# Altium schematic sheet 02_CtrlExp_Link.SchDoc: -
size A4; Date: -; ApprovedBy: -; CheckedBy: -; Author: -; CompanyName: -; DrawnBy: -; Engineer: -; Organization: Komax AG; Address1: -; Address2: -; Address3: -; Address4: -; DocumentNumber: -; Revision: -; SheetNumber: 2; SheetTotal: 8; KSDP_ObjectName: CtrlExp Link; KSDP_CreatedBy: Patrick Rossacher; KSDP_CreationDate: 20.12.2017; KSDP_ModificationDate: -; KSDP_ModifiedBy: -; CurrentTime: -; CurrentDate: -; Time: -; DocumentFullPathAndName: -; DocumentName: -; ModifiedDate: -; ImagePath: -
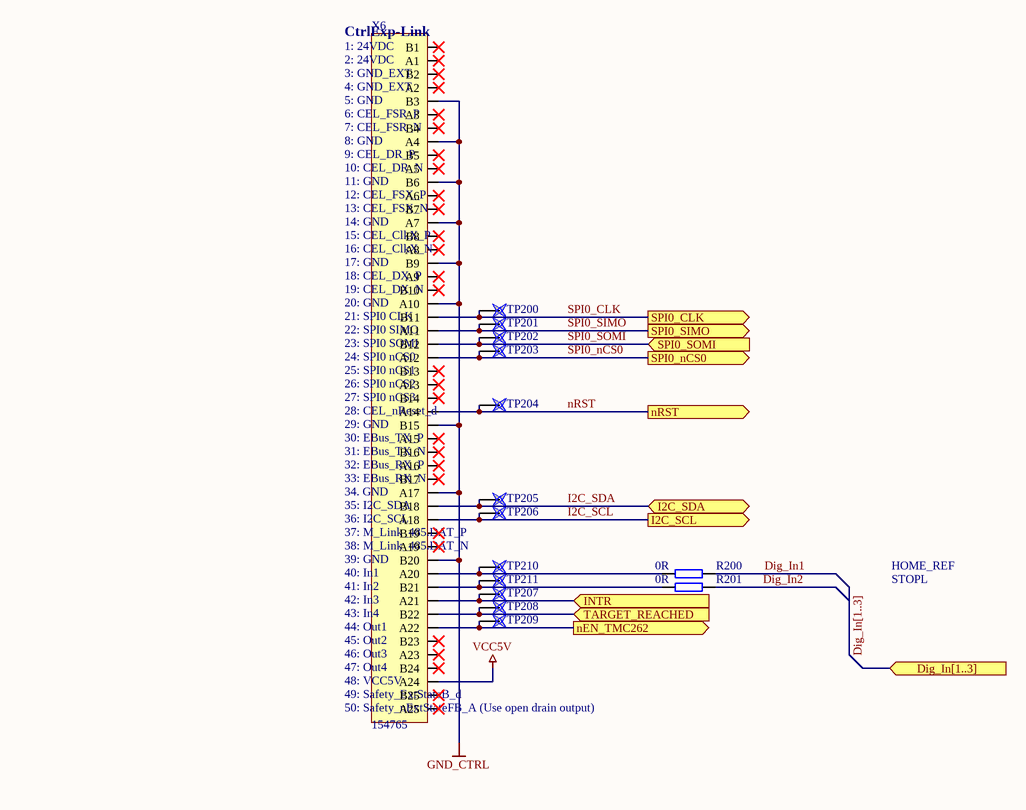
[diagram p0: 02_CtrlExp_Link.SchDoc]

## Parts
R200  0R  [0402_R]
R201  0R  [0402_R]
TP200  Testpoint  [TP1.5MM]  (value not drawn)  (no BOM)
TP201  Testpoint  [TP1.5MM]  (value not drawn)  (no BOM)
TP202  Testpoint  [TP1.5MM]  (value not drawn)  (no BOM)
TP203  Testpoint  [TP1.5MM]  (value not drawn)  (no BOM)
TP204  Testpoint  [TP1.5MM]  (value not drawn)  (no BOM)
TP205  Testpoint  [TP1.5MM]  (value not drawn)  (no BOM)
TP206  Testpoint  [TP1.5MM]  (value not drawn)  (no BOM)
TP207  Testpoint  [TP1.5MM]  (value not drawn)  (no BOM)
TP208  Testpoint  [TP1.5MM]  (value not drawn)  (no BOM)
TP209  Testpoint  [TP1.5MM]  (value not drawn)  (no BOM)
TP210  Testpoint  [TP1.5MM]  (value not drawn)  (no BOM)
TP211  Testpoint  [TP1.5MM]  (value not drawn)  (no BOM)
X6  154765  [CON_SMD_50P_ERNI_154765]

## Ports
Dig_In[1..3] (in), I2C_SCL (out), I2C_SDA (bidir), INTR (in), nEN_TMC262 (out), nRST (out), SPI0_CLK (out), SPI0_nCS0 (out), SPI0_SIMO (out), SPI0_SOMI (in), TARGET_REACHED (in)

## Nets
GND_CTRL: X6.A4 X6.A7 X6.A10 X6.A17 X6.B3 X6.B6 X6.B9 X6.B15 X6.B20
VCC5V: X6.A24
Dig_In1: R200.2
Dig_In2: R201.2
I2C_SCL: TP206.1 X6.A18 ; port I2C_SCL
I2C_SDA: TP205.1 X6.B18 ; port I2C_SDA
INTR: TP207.1 X6.A21 ; port INTR
nEN_TMC262: TP209.1 X6.A22 ; port nEN_TMC262
nRST: TP204.1 X6.A14 ; port nRST
SPI0_CLK: TP200.1 X6.B11 ; port SPI0_CLK
SPI0_nCS0: TP203.1 X6.A12 ; port SPI0_nCS0
SPI0_SIMO: TP201.1 X6.A11 ; port SPI0_SIMO
SPI0_SOMI: TP202.1 X6.B12 ; port SPI0_SOMI
TARGET_REACHED: TP208.1 X6.B22 ; port TARGET_REACHED
NetR200_1: R200.1 TP210.1 X6.A20
NetR201_1: R201.1 TP211.1 X6.B21

Not connected (* = marked no-connect by the designer): X6 A1* A2* A3* A5* A6* A8* A9* A13* A15* A16* A19* A23* A25* B1* B2* B4* B5* B7* B8* B10* B13* B14* B16* B17* B19* B23* B24* B25*

## Buses and harness runs
bus Dig_In[1..3] = port Dig_In[1..3]

## Notes on the sheet
- CtrlExp-Link
- 5: GND
- 1: 24VDC
- 2: 24VDC
- 6: CEL_FSR_P
- 3: GND_EXT
- 4: GND_EXT
- 7: CEL_FSR_N
- 8: GND
- 9: CEL_DR_P
- 10: CEL_DR_N
- 11: GND
- 12: CEL_FSX_P
- 13: CEL_FSX_N
- 14: GND
- 15: CEL_ClkX_P
- 16: CEL_ClkX_N
- 17: GND
- 18: CEL_DX_P
- 19: CEL_DX_N
- 20: GND
- 21: SPI0 CLK
- 22: SPI0 SIMO
- 23: SPI0 SOMI
- 24: SPI0 nCS0
- 25: SPI0 nCS1
- 26: SPI0 nCS2
- 27: SPI0 nCS3
- 29: GND
- 30: EBus_TX_P
- 28: CEL_nReset_d
- 34. GND
- 31: EBus_TX_N
- 32: EBus_RX_P
- 33: EBus_RX_N
- 35: I2C_SDA
- 36: I2C_SCL
- 39: GND
- 37: M_Link_485.DAT_P
- 40: In1
- 38: M_Link_485.DAT_N
- STOPL
- HOME_REF
- 41: In2
- 42: In3
- 43: In4
- 44: Out1
- 45: Out2
- 46: Out3
- 48: VCC5V
- 49: Safety_ExtStateB_d
- 50: Safety_nExtStateFB_A (Use open drain output)
- 47: Out4
- Project:
- ArtNo_Variant:
- Object:
- Creation Date:
- Modification Date:
- Created By:
- Modified By:
- DocNo:
- Index:
- Size, Template:
- A4, K_A4_V0006.SchDot
- Komax AG
  Industriestrasse 6
  CH-6036 Dierikon/LU
  Switzerland
- Print Date:
- File:
- Sheet
- of

## Library data of the parts
R200 R201 = RES2: Resistor 0.063W 1%; FootprintBOM: 0402
TP200-TP211 = P_PRUEFPAD: FootprintBOM: Testpoint
X6 = CON_50P_ERNI: Connector SMC 2x25p 90° 1.27mm; Manufacturer: ERNI; MaxTemp: 125; MinTemp: -55; 2ndSource: 15 15 050 5601 333 / Harting; 3rdSource: *; Bemerkung: 90°; Distributor: *; FootprintBOM: SMD RM=1.27mm; Notes: *; Reference: *; Strategic: *